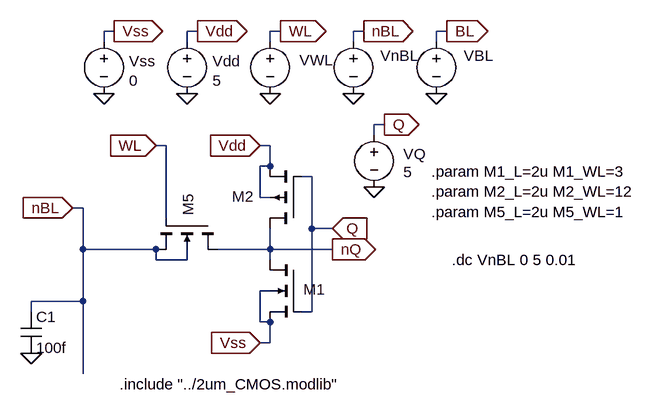
[diagram p0: schematic half-core.asc]
half-core.asc, the LTspice schematic file:
Version 4
SHEET 1 1180 1172
WIRE -640 -64 -656 -64
WIRE -512 -64 -528 -64
WIRE -384 -64 -400 -64
WIRE -256 -64 -272 -64
WIRE -128 -64 -144 -64
WIRE -656 -48 -656 -64
WIRE -528 -48 -528 -64
WIRE -400 -48 -400 -64
WIRE -272 -48 -272 -64
WIRE -144 -48 -144 -64
WIRE -224 80 -240 80
WIRE -240 96 -240 80
WIRE -560 112 -576 112
WIRE -400 112 -416 112
WIRE -400 144 -400 112
WIRE -400 144 -416 144
WIRE -336 160 -352 160
WIRE -416 192 -416 144
WIRE -400 192 -416 192
WIRE -688 208 -704 208
WIRE -560 224 -560 112
WIRE -336 240 -336 160
WIRE -304 240 -336 240
WIRE -688 272 -688 208
WIRE -576 272 -688 272
WIRE -400 272 -400 240
WIRE -400 272 -480 272
WIRE -304 272 -400 272
WIRE -576 288 -576 272
WIRE -528 288 -528 272
WIRE -528 288 -576 288
WIRE -400 288 -400 272
WIRE -400 336 -416 336
WIRE -688 352 -688 272
WIRE -688 352 -768 352
WIRE -768 368 -768 352
WIRE -336 368 -336 240
WIRE -336 368 -352 368
WIRE -416 384 -416 336
WIRE -400 384 -416 384
WIRE -400 416 -400 384
WIRE -400 416 -416 416
WIRE -688 464 -688 352
FLAG -528 32 0
FLAG -400 32 0
FLAG -512 -64 Vdd
IOPIN -512 -64 Out
FLAG -384 -64 WL
IOPIN -384 -64 Out
FLAG -272 32 0
FLAG -256 -64 nBL
IOPIN -256 -64 Out
FLAG -416 416 Vss
IOPIN -416 416 In
FLAG -704 208 nBL
IOPIN -704 208 In
FLAG -576 112 WL
IOPIN -576 112 In
FLAG -416 112 Vdd
IOPIN -416 112 In
FLAG -304 272 nQ
IOPIN -304 272 Out
FLAG -656 32 0
FLAG -640 -64 Vss
IOPIN -640 -64 Out
FLAG -304 240 Q
IOPIN -304 240 In
FLAG -144 32 0
FLAG -128 -64 BL
IOPIN -128 -64 Out
FLAG -768 432 0
FLAG -240 176 0
FLAG -224 80 Q
IOPIN -224 80 Out
SYMBOL pmos4 -352 240 R180
WINDOW 0 73 49 Left 2
WINDOW 3 55 45 Invisible 2
SYMATTR InstName M2
SYMATTR Value P_2u
SYMATTR Value2 l={M2_L} w={M2_L * M2_WL}
SYMBOL nmos4 -352 288 M0
WINDOW 0 -37 46 Left 2
WINDOW 3 -70 42 Invisible 2
SYMATTR InstName M1
SYMATTR Value N_2u
SYMATTR Value2 l={M1_L} w={M1_L * M1_WL}
SYMBOL voltage -528 -64 R0
WINDOW 0 39 46 Left 2
WINDOW 3 39 76 Left 2
SYMATTR InstName Vdd
SYMATTR Value 5
SYMBOL voltage -400 -64 R0
WINDOW 0 45 45 Left 2
WINDOW 3 45 74 Left 2
SYMATTR InstName VWL
SYMATTR Value ""
SYMBOL voltage -272 -64 R0
WINDOW 0 42 38 Left 2
WINDOW 3 44 69 Left 2
WINDOW 123 0 0 Left 0
WINDOW 39 0 0 Left 0
SYMATTR InstName VnBL
SYMATTR Value ""
SYMBOL nmos4 -480 224 R90
WINDOW 0 -37 46 Left 2
WINDOW 3 -70 42 Invisible 2
SYMATTR InstName M5
SYMATTR Value N_2u
SYMATTR Value2 l={M5_L} w={M5_L * M5_WL}
SYMBOL voltage -656 -64 R0
WINDOW 0 39 46 Left 2
WINDOW 3 39 76 Left 2
SYMATTR InstName Vss
SYMATTR Value 0
SYMBOL voltage -144 -64 R0
WINDOW 0 42 38 Left 2
WINDOW 3 44 69 Left 2
WINDOW 123 0 0 Left 0
WINDOW 39 0 0 Left 0
SYMATTR InstName VBL
SYMATTR Value ""
SYMBOL cap -784 368 R0
SYMATTR InstName C1
SYMATTR Value 100f
SYMBOL voltage -240 80 R0
WINDOW 0 45 45 Left 2
WINDOW 3 45 73 Left 2
WINDOW 123 0 0 Left 0
WINDOW 39 0 0 Left 0
SYMATTR InstName VQ
SYMATTR Value 5
TEXT -632 480 Left 2 !.include "../2um_CMOS.modlib"
TEXT -152 152 Left 2 !.param M1_L=2u M1_WL=3\n.param M2_L=2u M2_WL=12\n.param M5_L=2u M5_WL=1
TEXT -120 288 Left 2 !.dc VnBL 0 5 0.01

The netlist it stands for:
* half-core.asc
M2 nQ Q Vdd Vdd P_2u l={M2_L} w={M2_L * M2_WL}
M1 nQ Q Vss Vss N_2u l={M1_L} w={M1_L * M1_WL}
Vdd Vdd 0 5
VWL WL 0
VnBL nBL 0
M5 nQ WL nBL nBL N_2u l={M5_L} w={M5_L * M5_WL}
Vss Vss 0 0
VBL BL 0
C1 nBL 0 100f
VQ Q 0 5
.model NMOS NMOS
.model PMOS PMOS
.lib standard.mos
.include "../2um_CMOS.modlib"
.param M1_L=2u M1_WL=3
.param M2_L=2u M2_WL=12
.param M5_L=2u M5_WL=1
.dc VnBL 0 5 0.01
.backanno
.end